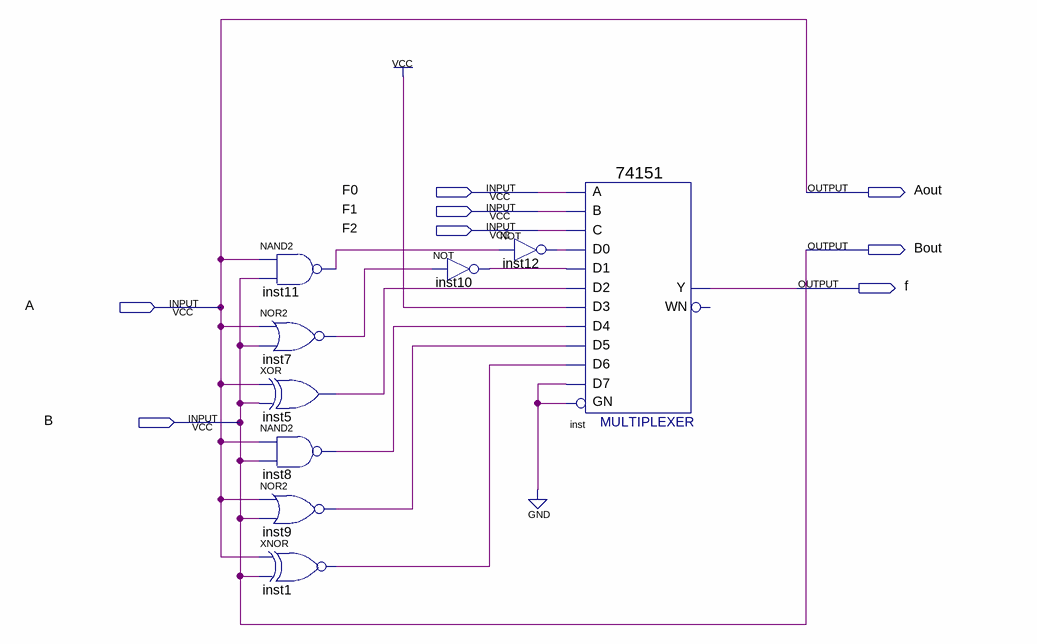
[diagram p0: schematic sheet]
// Quartus schematic Functionselect.bdf as structural Verilog: 9 symbols, 8 pins
module Functionselect (
  input  F0,
  input  F1,
  input  F2,
  input  A,
  input  B,
  output Aout,
  output Bout,
  output f
);

  wire inst1_out, inst5_out, inst7_out, inst8_out, inst9_out, inst10_out, inst11_out, inst12_out;

  nand inst11 (inst11_out, A, B);
  nor inst7 (inst7_out, A, B);
  xor inst5 (inst5_out, A, B);
  nand inst8 (inst8_out, A, B);
  nor inst9 (inst9_out, A, B);
  xnor inst1 (inst1_out, A, B);
  not inst10 (inst10_out, inst7_out);
  not inst12 (inst12_out, inst11_out);
  \74151  inst (
    .GN(1'b0), .C(F2), .B(F1), .A(F0), .D5(inst9_out), .D0(inst12_out), .D1(inst10_out), .D4(inst8_out),
    .D3(1'b1), .D2(inst5_out), .D6(inst1_out), .D7(1'b0), .Y(f));  // open: WN

  assign Aout = A;
  assign Bout = B;
endmodule
